# Altium schematic sheet Beam Freq to Volt Converter.SchDoc: Beam F/V
size OrCAD A; DocumentNumber: UG-003; Revision: 3
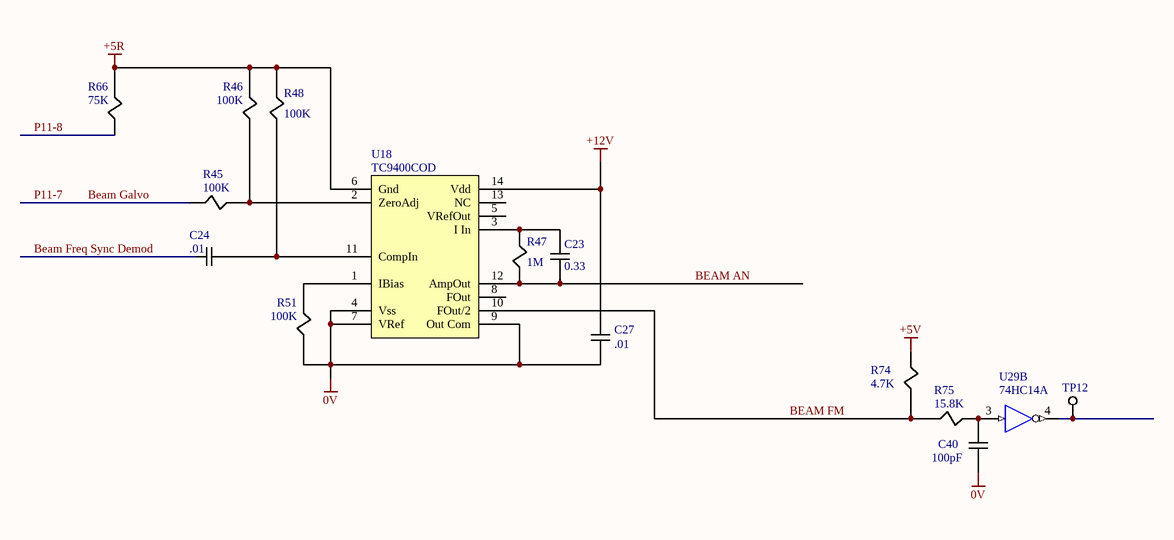
[diagram p0: Beam Freq to Volt Converter.SchDoc]

## Parts
C23  0.33  [RAD-0.1]
C24  .01  [RAD-0.1]
C27  .01  [RAD-0.1]
C40  100pF  [RAD-0.1]
R45  100K  [1206]
R46  100K  [1206]
R47  1M  [1206]
R48  100K  [1206]
R51  100K  [1206]
R66  75K  [1206]
R74  4.7K  [1206]
R75  15.8K  [1206]
TP12  (no value)  [TESTPOINT .45]
U18  TC9400COD
U29  74HC14A  [DIP14]  (part B of 6)

## Nets
0V: C27.2 C40.2 R51.1 U18.4(Vss) U18.7(VRef) U18.9(Out_Com)
+5R: R46.2 R48.2 R66.2 U18.6(Gnd)
+5V: R74.2
+12V: C27.1 U18.14(Vdd)
GND: U29.7(GND)
VCC: U29.14(VCC)
BEAM AN: C23.1 R47.1 U18.12(AmpOut)
BEAM FM: R74.1 R75.1 U18.10(FOut/2)
Beam Freq Sync Demod: C24.1
Beam Galvo: R45.1  [also labelled P11-7]
P11-8: R66.1
NetC23_2: C23.2 R47.2 U18.3(I_In)
NetC24_2: C24.2 R48.1 U18.11(CompIn)
NetC40_1: C40.1 R75.2 U29.3(A)
NetR45_2: R45.2 R46.1 U18.2(ZeroAdj)
NetR51_2: R51.2 U18.1(IBias)
NetTP12_1: TP12.1 U29.4(Y)

Not connected (* = marked no-connect by the designer): U18 5(VRefOut) 8(FOut) 13(NC)

## Notes on the sheet
- Title
- Size:
- Date:
- Orcad A
- Number:
- Time:
- Revision:
- Sheet
- of
- ZLS Corporation
- 7801 North Lamar Blvd
- Suite E-184
- Austin, TX  78752
- Phone: (512) 453-0288
- File:

## Library data of the parts
C23 C24 C27 C40 = CAP B
R45-R48 R51 R66 R74 R75 = RES1
TP12 = TESTPOINT A
U18 = TC9400 - F/V
U29 = 7404